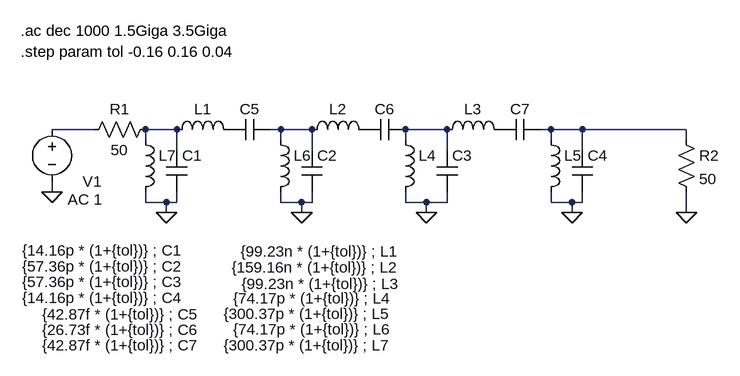
[diagram p0: schematic bandpass_scaled.asc]
bandpass_scaled.asc, the LTspice schematic file:
Version 4
SHEET 1 1000 680
WIRE -96 96 -160 96
WIRE 32 96 -16 96
WIRE 192 96 176 96
WIRE 240 96 192 96
WIRE 448 96 384 96
WIRE 608 96 592 96
WIRE 656 96 608 96
WIRE 816 96 656 96
WIRE -16 112 -16 96
WIRE 192 112 192 96
WIRE 384 112 384 96
WIRE 608 112 608 96
WIRE 816 112 816 96
WIRE 32 128 32 96
WIRE 240 128 240 96
WIRE 448 128 448 96
WIRE 656 128 656 96
WIRE -160 192 -160 176
WIRE -16 208 -16 192
WIRE 16 208 -16 208
WIRE 32 208 32 192
WIRE 32 208 16 208
WIRE 192 208 192 192
WIRE 224 208 192 208
WIRE 240 208 240 192
WIRE 240 208 224 208
WIRE 384 208 384 192
WIRE 416 208 384 208
WIRE 448 208 448 192
WIRE 448 208 416 208
WIRE 608 208 608 192
WIRE 640 208 608 208
WIRE 656 208 656 192
WIRE 656 208 640 208
WIRE 16 224 16 208
WIRE 224 224 224 208
WIRE 416 224 416 208
WIRE 640 224 640 208
WIRE 816 224 816 192
FLAG -160 192 0
FLAG 16 224 0
FLAG 224 224 0
FLAG 416 224 0
FLAG 640 224 0
FLAG 816 224 0
SYMBOL ind 16 112 R270
WINDOW 0 32 56 VTop 2
WINDOW 3 -156 238 VBottom 2
SYMATTR InstName L1
SYMATTR Value {99.23n * (1+{tol})} ; L1
SYMBOL ind 224 112 R270
WINDOW 0 32 56 VTop 2
WINDOW 3 -181 23 VBottom 2
SYMATTR InstName L2
SYMATTR Value {159.16n * (1+{tol})} ; L2
SYMBOL ind 432 112 R270
WINDOW 0 32 56 VTop 2
WINDOW 3 -206 -177 VBottom 2
SYMATTR InstName L3
SYMATTR Value {99.23n * (1+{tol})} ; L3
SYMBOL cap 16 128 R0
WINDOW 3 -222 154 Left 2
SYMATTR Value {14.16p * (1+{tol})} ; C1
SYMATTR InstName C1
SYMBOL cap 224 128 R0
WINDOW 3 -430 179 Left 2
SYMATTR Value {57.36p * (1+{tol})} ; C2
SYMATTR InstName C2
SYMBOL cap 432 128 R0
WINDOW 3 -638 203 Left 2
SYMATTR Value {57.36p * (1+{tol})} ; C3
SYMATTR InstName C3
SYMBOL res 0 80 R90
WINDOW 0 0 56 VBottom 2
WINDOW 3 32 56 VTop 2
SYMATTR InstName R1
SYMATTR Value 50
SYMBOL voltage -160 80 R0
WINDOW 0 47 96 Left 2
WINDOW 123 24 124 Left 2
WINDOW 39 0 0 Left 0
SYMATTR InstName V1
SYMATTR Value2 AC 1
SYMATTR Value ""
SYMBOL cap 640 128 R0
WINDOW 3 -846 227 Left 2
SYMATTR Value {14.16p * (1+{tol})} ; C4
SYMATTR InstName C4
SYMBOL res 800 96 R0
SYMATTR InstName R2
SYMATTR Value 50
SYMBOL ind 368 96 R0
WINDOW 3 -249 260 Left 2
SYMATTR Value {74.17p * (1+{tol})} ; L4
SYMATTR InstName L4
SYMBOL ind 592 96 R0
WINDOW 3 -488 284 Left 2
SYMATTR Value {300.37p * (1+{tol})} ; L5
SYMATTR InstName L5
SYMBOL ind 176 96 R0
WINDOW 3 -57 308 Left 2
SYMATTR Value {74.17p * (1+{tol})} ; L6
SYMATTR InstName L6
SYMBOL ind -32 96 R0
WINDOW 3 136 332 Left 2
SYMATTR Value {300.37p * (1+{tol})} ; L7
SYMATTR InstName L7
SYMBOL cap 176 80 R90
WINDOW 0 0 32 VBottom 2
WINDOW 3 285 229 VTop 2
SYMATTR InstName C5
SYMATTR Value {42.87f * (1+{tol})} ; C5
SYMBOL cap 384 80 R90
WINDOW 0 0 32 VBottom 2
WINDOW 3 309 437 VTop 2
SYMATTR InstName C6
SYMATTR Value {26.73f * (1+{tol})} ; C6
SYMBOL cap 592 80 R90
WINDOW 0 0 32 VBottom 2
WINDOW 3 333 645 VTop 2
SYMATTR InstName C7
SYMATTR Value {42.87f * (1+{tol})} ; C7
TEXT -208 -56 Left 2 !.ac dec 1000 1.5Giga 3.5Giga
TEXT -208 -24 Left 2 !.step param tol -0.16 0.16 0.04

The netlist it stands for:
* bandpass_scaled.asc
L1 N002 P001 {99.23n * (1+{tol})} ; L1
L2 N003 P002 {159.16n * (1+{tol})} ; L2
L3 N004 P003 {99.23n * (1+{tol})} ; L3
C1 N002 0 {14.16p * (1+{tol})} ; C1
C2 N003 0 {57.36p * (1+{tol})} ; C2
C3 N004 0 {57.36p * (1+{tol})} ; C3
R1 N002 N001 50
V1 N001 0 AC 1
C4 N005 0 {14.16p * (1+{tol})} ; C4
R2 N005 0 50
L4 N004 0 {74.17p * (1+{tol})} ; L4
L5 N005 0 {300.37p * (1+{tol})} ; L5
L6 N003 0 {74.17p * (1+{tol})} ; L6
L7 N002 0 {300.37p * (1+{tol})} ; L7
C5 N003 P001 {42.87f * (1+{tol})} ; C5
C6 N004 P002 {26.73f * (1+{tol})} ; C6
C7 N005 P003 {42.87f * (1+{tol})} ; C7
.ac dec 1000 1.5Giga 3.5Giga
.step param tol -0.16 0.16 0.04
.backanno
.end